# Altium schematic sheet TTTConsole.SchDoc
size A4
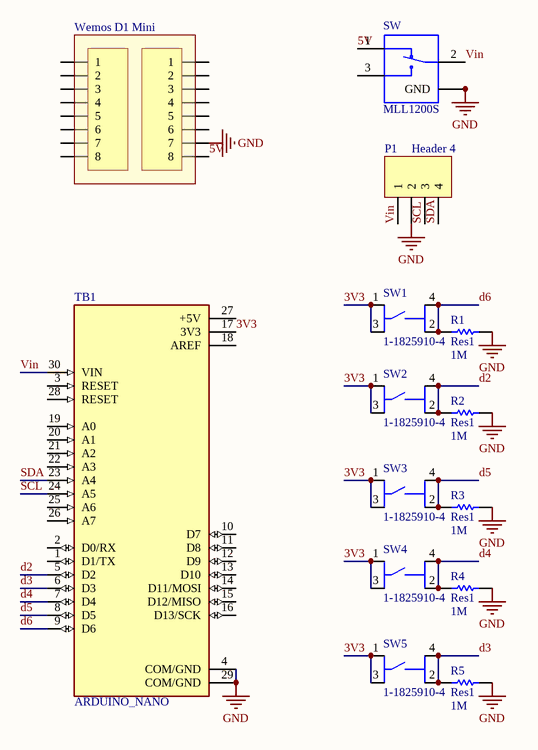
[diagram p0: TTTConsole.SchDoc]

## Parts
P1  Header 4  [HDR1X4]
P2  Header 8  [HDR1X8]  (value not drawn)
P3  Header 8  [HDR1X8]  (value not drawn)
R1  Res1  value 1M  [AXIAL-0.3]
R2  Res1  value 1M  [AXIAL-0.3]
R3  Res1  value 1M  [AXIAL-0.3]
R4  Res1  value 1M  [AXIAL-0.3]
R5  Res1  value 1M  [AXIAL-0.3]
SW  MLL1200S  [SW_MLL1200S]
SW1  1-1825910-4  [TE_1-1825910-4]
SW2  1-1825910-4  [TE_1-1825910-4]
SW3  1-1825910-4  [TE_1-1825910-4]
SW4  1-1825910-4  [TE_1-1825910-4]
SW5  1-1825910-4  [TE_1-1825910-4]
TB1  ARDUINO_NANO  [SHIELD_ARDUINO_NANO]

## Blocks framed on the sheet
Wemos D1 Mini: P2 P3

## Nets
GND: P1.2 P3.7 R1.2 R2.2 R3.2 R4.2 R5.2 SW.G1(GND) SW.G2(GND) SW.G3(GND) SW.G4(GND) TB1.4(COM/GND) TB1.29(COM/GND)
3V3: SW1.1 SW1.3 SW2.1 SW2.3 SW3.1 SW3.3 SW4.1 SW4.3 SW5.1 SW5.3 TB1.17(3V3)
5V: P3.8 SW.1
d2: R2.1 SW2.2 SW2.4 TB1.5(D2)
d3: R5.1 SW5.2 SW5.4 TB1.6(D3)
d4: R4.1 SW4.2 SW4.4 TB1.7(D4)
d5: R3.1 SW3.2 SW3.4 TB1.8(D5)
d6: R1.1 SW1.2 SW1.4 TB1.9(D6)
SCL: P1.3 TB1.24(A5)
SDA: P1.4 TB1.23(A4)
Vin: P1.1 SW.2 TB1.30(VIN)

Not connected (* = marked no-connect by the designer): P2 1 2 3 4 5 6 7 8; P3 1 2 3 4 5 6; SW 3; TB1 1(D1/TX) 2(D0/RX) 3(RESET) 10(D7) 11(D8) 12(D9) 13(D10) 14(D11/MOSI) 15(D12/MISO) 16(D13/SCK) 18(AREF) 19(A0) 20(A1) 21(A2) 22(A3) 25(A6) 26(A7) 27(+5V) 28(RESET)

## Library data of the parts
P1 = Header 4: Header, 4-Pin; LatestRevisionDate: 17-Jul-2002; LatestRevisionNote: Re-released for DXP Platform.; Publisher: Altium Limited
P2 P3 = Header 8: Header, 8-Pin; LatestRevisionDate: 17-Jul-2002; LatestRevisionNote: Re-released for DXP Platform.; Publisher: Altium Limited
R1-R5 = Res1: Resistor; Published: 8-Jun-2000; LatestRevisionDate: 17-Jul-2002; LatestRevisionNote: Re-released for DXP Platform.; PackageReference: AXIAL-0.3; Publisher: Altium Limited; PackageDescription: Axial Device, Thru-Hole; 2 Leads; 0.3 in Pin Spacing
SW = MLL1200S: Slide Switch SPDT Surface Mount, Right Angle; MF: TE Connectivity; Value: *; Package: None; Digi-Key_Purchase_URL: https://www.digikey.lt/product-detail/en/te-connectivity-alcoswitch-switches/MLL1200S/450-1577-ND/1201378?utm_source=snapeda&utm_medium=aggregator&utm_campaign=symbol; Digi-Key_Part_Number: 450-1577-ND; TE_purchase_URL: https://www.te.com/usa-en/product-1437575-1.html?te_bu=Cor&te_type=disp&te_campaign=seda_glo_cor-seda-global-disp-prtnr-fy19-seda-model-bom-cta_sma-317_1&elqCampaignId=32493; SnapEDA_Link: https://www.snapeda.com/parts/MLL1200S/TE%20Connectivity%20ALCOSWITCH%20Switches/view-part/1494234/?ref=snap; MP: MLL1200S
SW1-SW5 = 1-1825910-4: Switch Tactile OFF _ON_ SPST Round Button PC Pins 0.05A 24VDC 100000Cycles 1.56N Thru-Hole; MF: TE Connectivity; Availability: Unavailable; SnapEDA_Link: https://www.snapeda.com/parts/1-1825910-4/TE%20Connectivity%20ALCOSWITCH%20Switches/view-part/558688/?ref=snap; Price: None; EU_RoHS_Compliance: Compliant; Package: None; TE_purchase_URL: https://www.te.com/usa-en/product-1-1825910-4.html?te_bu=Cor&te_type=disp&te_campaign=seda_glo_cor-seda-global-disp-prtnr-fy19-seda-model-bom-cta_sma-317_1&elqCampaignId=32493; MP: 1-1825910-4; Value: *
TB1 = ARDUINO_NANO: ATSAMD21G18A Arduino Nano 33 IoT SAM D ARMÂ® CortexÂ®-M0+ MCU 32-Bit Embedded Evaluation Board; MP: ARDUINO NANO; Package: None; Price: None; Availability: Unavailable; Value: *; MF: Arduino; SnapEDA_Link: https://www.snapeda.com/parts/ARDUINO%20NANO/Arduino/view-part/1128261/?ref=snap